# Altium project ATRACK_KEY_V2.PrjPCB
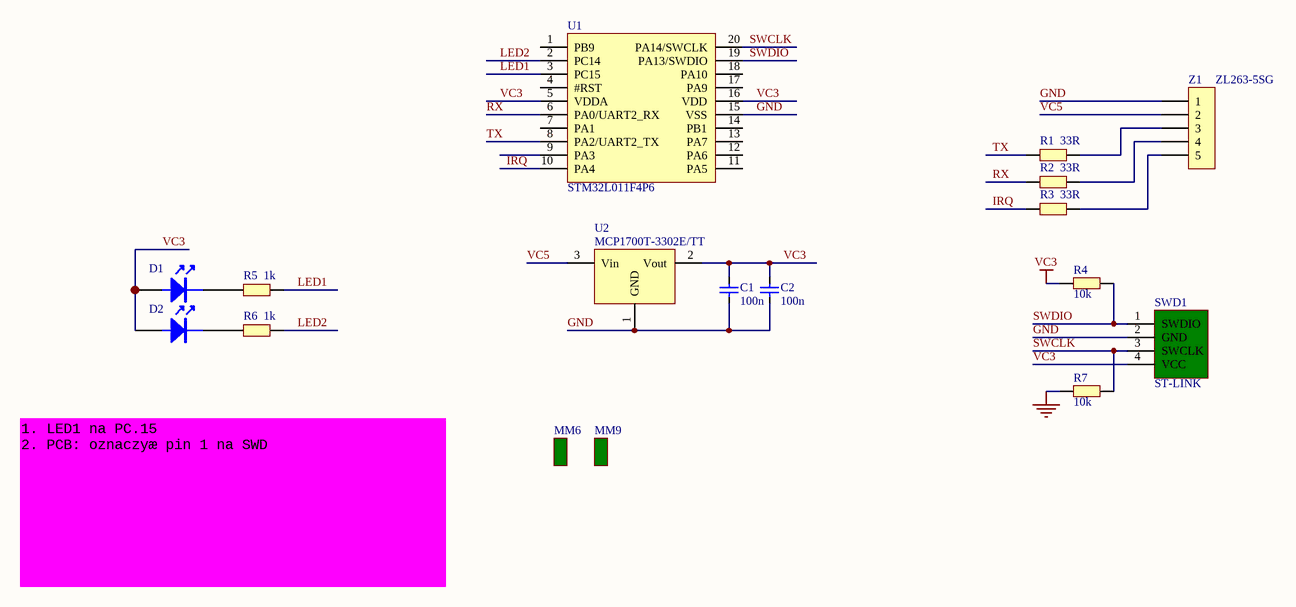
[diagram p0: ATRACK_KEY_V2.SchDoc]
1 sheet, 17 parts. Net scope: global (net labels, ports and power ports of the same name join across sheets).
Board file: ATRACK_KEY_V2.PcbDoc

## Sheet ATRACK_KEY_V2.SchDoc
size A4

### Parts
C1  100n  [0603C]
C2  100n  [0603C]
D1  (no value)  [0603LG]
D2  (no value)  [0603LR]
MM6  (no value)  [REF_CIR]
MM9  (no value)  [REF_SQR]
R1  33R  [0603R]
R2  33R  [0603R]
R3  33R  [0603R]
R4  10k  [0603R]
R5  1k  [0603R]
R6  1k  [0603R]
R7  10k  [0603R]
SWD1  ST-LINK  [PIN4]
U1  STM32L011F4P6  [TSSOP20]
U2  MCP1700T-3302E/TT  [SOT-23]
Z1  ZL263-5SG  [PIN5_ZL]

### Nets
GND: C1.2 C2.2 R7.1 SWD1.2(GND) U1.15(VSS) U2.1(GND) Z1.1
VC3: C1.1 C2.1 D1.A D2.A R4.1 SWD1.4(VCC) U1.5(VDDA) U1.16(VDD) U2.2(Vout)
IRQ: R3.1 U1.10(PA4)
LED1: R5.2 U1.3(PC15)
LED2: R6.2 U1.2(PC14)
RX: R2.1 U1.6(PA0/UART2_RX)
SWCLK: R7.2 SWD1.3(SWCLK) U1.20(PA14/SWCLK)
SWDIO: R4.2 SWD1.1(SWDIO) U1.19(PA13/SWDIO)
TX: R1.1 U1.8(PA2/UART2_TX)
VC5: U2.3(Vin) Z1.2
NetD1_K: D1.K R5.1
NetD2_K: D2.K R6.1
NetR1_2: R1.2 Z1.3
NetR2_2: R2.2 Z1.4
NetR3_2: R3.2 Z1.5

Not connected (* = marked no-connect by the designer): U1 1(PB9) 4(#RST) 7(PA1) 9(PA3) 11(PA5) 12(PA6) 13(PA7) 14(PB1) 17(PA9) 18(PA10)

### Notes on the sheet
- 1. LED1 na PC.15
  2. PCB: oznaczyæ pin 1 na SWD

### Library data of the parts
C1 C2 = CAP
D1 D2 = LED
MM6 MM9 = MECH
R1-R7 = RES3
SWD1 = SW_CON: Header, 4-Pin; LatestRevisionDate: 17-Jul-2002; LatestRevisionNote: Re-released for DXP Platform.; Publisher: Altium Limited
Z1 = CON5: Connector